# EAGLE schematic GateKeeper (EAGLE 9.6.2)
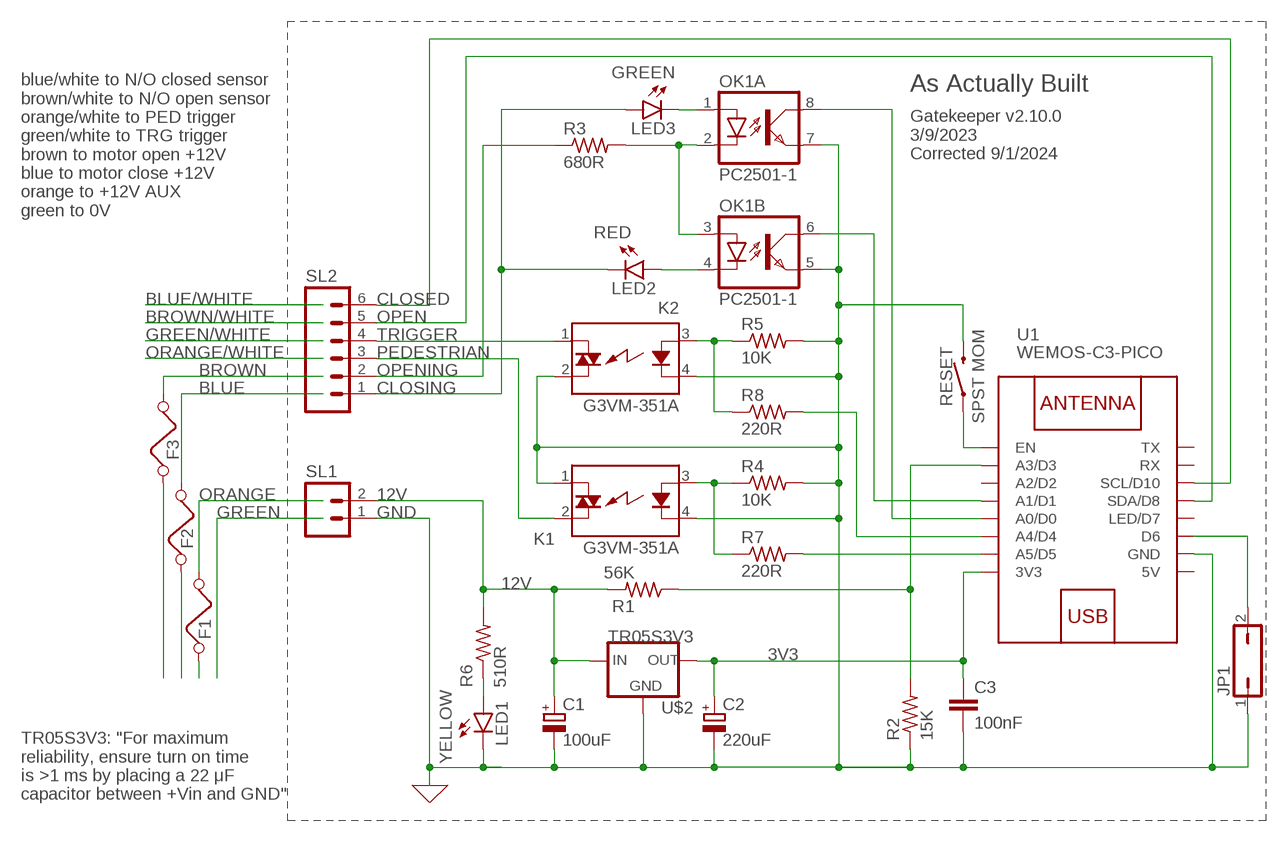
[diagram p0: schematic, sheet 1]

## Parts
C1  100uF  CPOL-EUE2.5-5  [E2,5-5]
C2  220uF  CPOL-EUE2.5-5  [E2,5-5]
C3  100nF  C2.5/2  [C2.5-2]
F1  FUSE  [FUSE]
F2  FUSE  [FUSE]
F3  FUSE  [FUSE]
JP1  JP1Q  [JP1]
K1  G3VM-351A  S202SE1  [S2XXEX]
K2  G3VM-351A  S202SE1  [S2XXEX]
LED1  YELLOW  LED5MM  [LED5MM]
LED2  RED  LED5MM  [LED5MM]
LED3  GREEN  LED5MM  [LED5MM]
OK1  PC2501-1  PC827  [DIL08]
R1  56K  R-US_0207/10  [0207/10]
R2  15K  R-US_0207/10  [0207/10]
R3  680R  R-US_0207/10  [0207/10]
R4  10K  R-US_0207/10  [0207/10]
R5  10K  R-US_0207/10  [0207/10]
R6  510R  R-US_0207/10  [0207/10]
R7  220R  R-US_0207/10  [0207/10]
R8  220R  R-US_0207/10  [0207/10]
RESET  SPST MOM  MOMENTARY-SWITCH-SPST-PTH-6.0MM  [TACTILE_SWITCH_PTH_6.0MM]
SL1  M02  [02P]
SL2  M06  [06P]
U1  WEMOS-C3-PICO  WEMOS-C3-PICOWEMOS-C3-PICO  [WEMOS-C3-PICO]
U$2  TR05S3V3  V_REG_LD1117VXX  [78XXL]

## Nets
3V3: C2.+ C3.1 U1.JP1.1(3V3) U$2.GND(OUT)
12V: C1.+ R1.2 R6.2 SL1.2 U$2.OUT(IN)
BLUE: F2.2
BROWN: F3.2
CLOSED: SL2.6 U1.JP2.6(SCL/D10)
CLOSING: LED2.K(C) LED3.A SL2.1
GND: C1.- C2.- C3.2 JP1.1 K1.1(DS1) K1.4(K) K2.2(DS2) K2.4(K) LED1.K(C) OK1.5(B:EMIT) OK1.7(A:EMIT) R2.1 R4.2 R5.2 RESET.3 SL1.1 U1.JP2.2(GND) U$2.IN(GND)
N$1: LED2.A OK1.4(B:C)
N$2: R7.2 U1.JP1.8(A5/D5)
N$3: OK1.6(B:COL) U1.JP1.4(A1/D1)
N$4: LED3.K(C) OK1.1(A:A)
N$5: F1.1
N$6: OK1.8(A:COL) U1.JP1.3(A0/D0)
N$7: K2.3(A) R5.1 R8.1
N$8: F2.1
N$9: LED1.A R6.1
N$10: R1.1 R2.2 U1.JP1.6(A3/D3)
N$11: F3.1
N$12: RESET.1 U1.JP2.4(EN)
N$13: JP1.2 U1.JP2.1(D6)
N$14: R8.2 U1.JP1.7(A4/D4)
N$16: K1.3(A) R4.1 R7.1
N$21: OK1.2(A:C) OK1.3(B:A) R3.2
OPEN: SL2.5 U1.JP2.7(SDA/D8)
OPENING: R3.1 SL2.2
ORANGE: F1.2
PEDESTRIAN: K1.2(DS2) SL2.3
TRIGGER: K2.1(DS1) SL2.4
Unconnected: U1.JP1.5(A2/D2) U1.JP2.3(LED/D7) U1.JP2.5(RX) U1.JP2.8(TX)

## Notes on the sheet
- As Actually Built
- Gatekeeper v2.10.0
  3/9/2023
  Corrected 9/1/2024
- blue/white to N/O closed sensor
  brown/white to N/O open sensor
  orange/white to PED trigger
  green/white to TRG trigger
  brown to motor open +12V
  blue to motor close +12V
  orange to +12V AUX
  green to 0V
- TR05S3V3: "For maximum
  reliability, ensure turn on time
  is >1 ms by placing a 22 μF
  capacitor between +Vin and GND"

## Power pins joined to a net without a drawn wire
5V: U1.JP1.2(5V)

## Library data of the parts
C1 C2 = rcl:CPOL-EU: POLARIZED CAPACITOR, European symbol; SPICEPREFIX: C
C3 = capacitor-wima:C: CAPACITOR naming: grid - package width
F1-F3 = special:FUSE: FUSE 5 x 20 mm
JP1 = jumper:JP1Q: JUMPER
K1 K2 = relay:S2*: SIP Type SSR for Medium Power Control SHARP Source: 168149-da-01-en-Solid_State_Relais_S_202_SE1_SE2.pdf; OC_FARNELL: unknown; OC_NEWARK: unknown
LED1-LED3 = led:LED: LED OSRAM: - CHIPLED LG R971, LG N971, LY N971, LG Q971, LY Q971, LO R971, LY R971 LH N974, LH R974 LS Q976, LO Q976, LY Q976 LO Q996 - Hyper CHIPLED LW Q18S LB Q993, LB Q99A, LB R99A - SideLED LS A670, LO A670, LY A670, LG A670, LP A670 LB A673, LV A673, LT A673, LW A673 LH A674 LY A675 LS A676, LA A676, LO A676, LY A676, LW A676 LS A679, LY A679, LG A679 - Hyper Micro SIDELED® LS Y876, LA Y876, LO Y876, LY Y876 LT Y87S - SmartLED LW L88C, LW L88S LB L89C, LB L89S, LG L890 LS L89K, LO L89K, LY L89K LS L896, LA L896, LO L896, LY L896 - TOPLED LS T670, LO T670, LY T670, LG T670, LP T670 LSG T670, LSP T670, LSY T670, LOP T670, LYG T670 LG T671, LOG T671, LSG T671 LB T673, LV T673, LT T673, LW T673 LH T674 LS T676, LA T676, LO T676, LY T676, LB T676, LH T676, LSB T676, LW T676 LB T67C, LV T67C, LT T67C, LS T67K, LO T67K, LY T67K, LW E67C LS E67B, LA E67B, LO E67B, LY E67B, LB E67C, LV E67C, LT E67C LW T67C LS T679, LY T679, LG T679 LS T770, LO T770, LY T770, LG T770, LP T770 LB T773, LV T773, LT T773, LW T773 LH T774 LS E675, LA E675, LY E675, LS T675 LS T776, LA T776, LO T776, LY T776, LB T776 LHGB T686 LT T68C, LB T68C - Hyper Mini TOPLED® LB M676 - Mini TOPLED Santana® LG M470 LS M47K, LO M47K, LY M47K Source: http://www.osram.convergy.de LUXEON: - LUMILED® LXK2-PW12-R00, LXK2-PW12-S00, LXK2-PW14-U00, LXK2-PW14-V00 LXK2-PM12-R00, LXK2-PM12-S00, LXK2-PM14-U00 LXK2-PE12-Q00, LXK2-PE12-R00, LXK2-PE12-S00, LXK2-PE14-T00, LXK2-PE14-U00 LXK2-PB12-K00, LXK2-PB12-L00, LXK2-PB12-M00, LXK2-PB14-N00, LXK2-PB14-P00, LXK2-PB14-Q00 LXK2-PR12-L00, LXK2-PR12-M00, LXK2-PR14-Q00, LXK2-PR14-R00 LXK2-PD12-Q00, LXK2-PD12-R00, LXK2-PD12-S00 LXK2-PH12-R00, LXK2-PH12-S00 LXK2-PL12-P00, LXK2-PL12-Q00, LXK2-PL12-R00 Source: www.luxeon.com KINGBRIGHT: KA-3528ASYC Source: www.kingbright.com
OK1 = optocoupler:PC827: SHARP OPTO COUPLER; OC_FARNELL: unknown; OC_NEWARK: unknown
R1-R8 = rcl:R-US_: RESISTOR, American symbol; SPICEPREFIX: R
RESET = SparkFun-Switches:MOMENTARY-SWITCH-SPST: Momentary Switch (Pushbutton) - SPST Normally-open (NO) SPST momentary switches (buttons, pushbuttons). Variants PTH-12MM - 12mm square, through-hole Momentary Pushbutton Switch - 12mm Square <https://www.sparkfun.com/products/9190> (COM-09190) PTH-6.0MM, PTH-6.0MM-KIT - 6.0mm square, through-hole Mini Pushbutton Switch <https://www.sparkfun.com/products/97> (COM-00097) KIT package intended for soldering kit's - only one side of pads' copper is exposed. PTH-RIGHT-ANGLE-KIT - Right-angle, through-hole Right Angle Tactile Button <https://www.sparkfun.com/products/10791> - Used on SparkFun BigTime Watch Kit <https://www.sparkfun.com/products/11734> SMD-12MM - 12mm square, surface-mount Tactile Button - SMD (12mm) <https://www.sparkfun.com/products/12993> (COM-12993) Used on SparkFun PicoBoard <https://www.sparkfun.com/products/11888> SMD-4.5MM - 4.5mm Square Trackball Switch Used on SparkFun Blackberry Trackballer Breakout <https://www.sparkfun.com/products/13169> SMD-4.6MMX2.8MM - 4.60mm x 2.80mm, surface mount Used on SparkFun SAMD21 Mini Breakout <https://www.sparkfun.com/products/13664> SMD-5.2MM, SMD-5.2-REDUNDANT - 5.2mm square, surface-mount Mini Pushbutton Switch - SMD <https://www.sparkfun.com/products/8720> (COM-08720) Used on Arduino Pro Mini <https://www.sparkfun.com/products/11114> REDUNDANT package connects both switch circuits together SMD-6.0X3.5MM - 6.0 x 3.5mm, surface mount Momentary Reset Switch SMD <https://www.sparkfun.com/products/8229> (COM-08229) SMD-6.2MM-TALL - 6.2mm square, surface mount Tactile Button - SMD (6mm) <https://www.sparkfun.com/products/12992> Used on SparkFun Digital Sandbox <https://www.sparkfun.com/products/12651> SMD-RIGHT-ANGLE - Right-angle, surface mount Used on SparkFun Block for Intel® Edison - Arduino <https://www.sparkfun.com/products/13036>; PROD_ID: SWCH-08441; SF_SKU: COM-00097
SL1 = con-amp-quick:M02: AMP QUICK CONNECTOR; OC_FARNELL: unknown; OC_NEWARK: unknown
SL2 = con-amp-quick:M06: AMP QUICK CONNECTOR; OC_FARNELL: unknown; OC_NEWARK: unknown
U1 = Modules:WEMOS-C3-PICO: WEMOS C3 Pico: Mini Wi-Fi Board based on ESP32 C3 device More details can be found here: https://www.wemos.cc/en/latest/c3/index.html
U$2 = SparkFun-IC-Power:V_REG_LD1117VXX: LD1117VXX voltage regulator. We carry the 3.3V version (COM-00526) in TO-220 package.